# EAGLE board untitled (EAGLE 9.6.2)
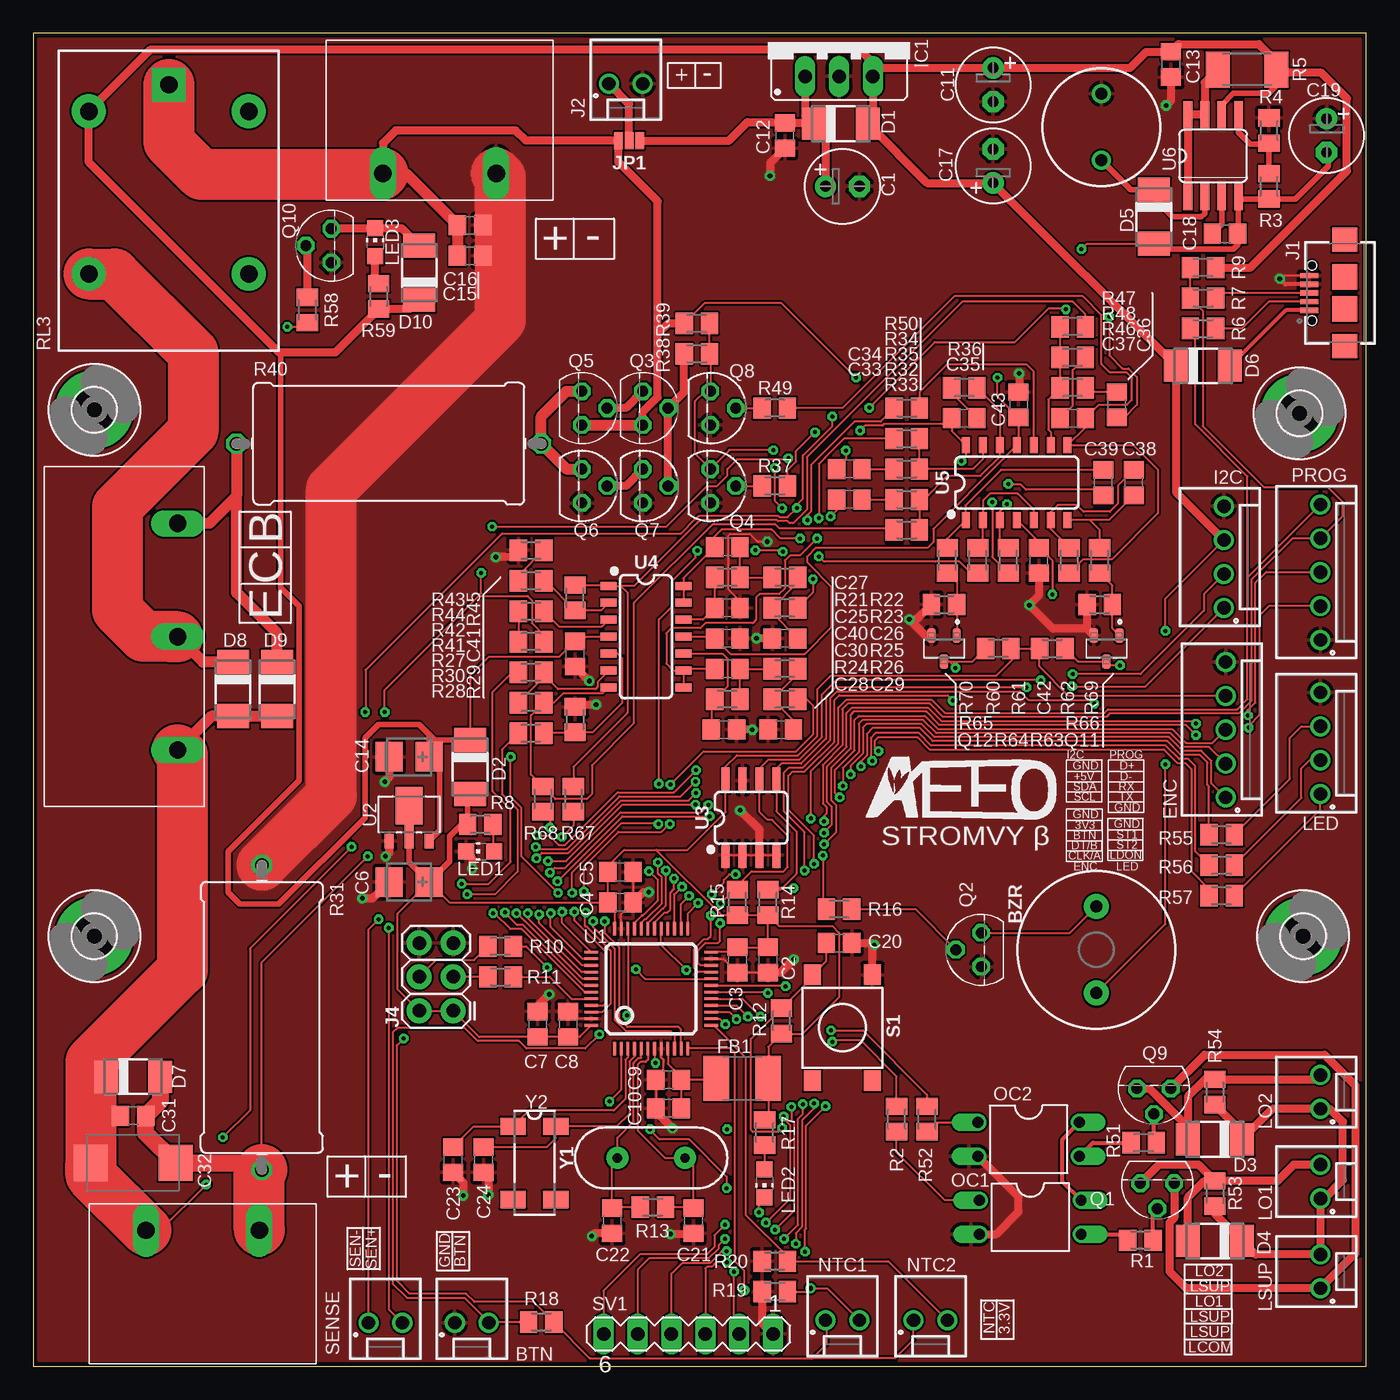
[diagram p1: board, top side]
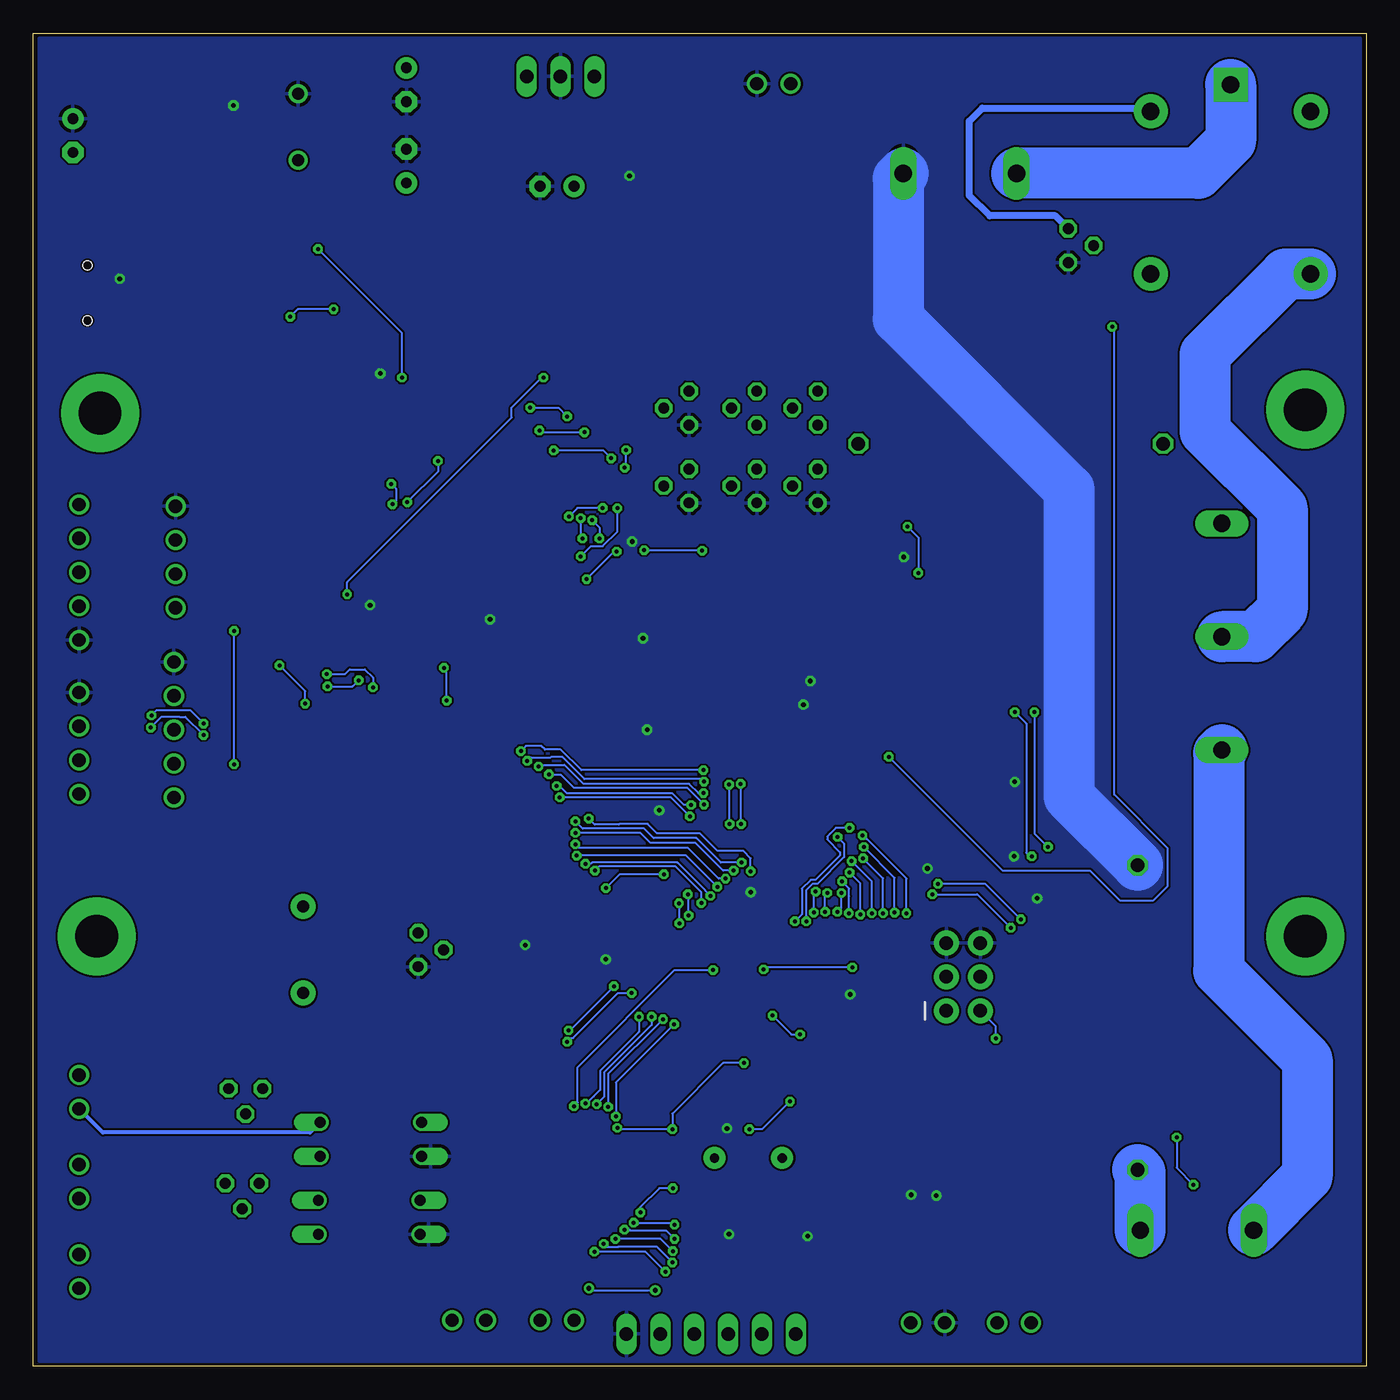
[diagram p2: board, bottom side, seen from below]

Size 100 x 100 mm. Coordinates in mm from the lower left corner, seen from the top.
Outline: 0,0 100,0 100,100 0,100 0,0
Copper layers (1*16): Top 0.035mm / dielectric 1.5mm / Bottom 0.035mm
Design rules "default *": minimum track width 6mil, minimum drill 0.3mm, track to track 6mil, track to pad 6mil, pad to pad 6mil, via to via 6mil, smd to smd 6mil, copper to edge 6mil, drill to drill 6mil, minimum pad ring 10mil, minimum via ring 8mil, stop-mask expansion 4mil, vias tented up to drill 20mil, thermal gap 10mil

## Footprints (pad centres in the part's own frame; a part is rotated, then mirrored left to right if it is on the bottom)
61900211121 = drill 1: 1 1.27,0.3; 2 -1.27,0.3
BUZZER-12MM-KIT = drill 0.9 pad 1.88: + 3.25,0; - -3.25,0
E2,5-6 = drill 0.813 pad 1.6: + -1.27,0 | drill 0.813 pad 1.6 octagon: - 1.27,0
C0805 = smd 1.3 x 1.5: 1 -0.95,0; 2 0.95,0
CT3528 = smd 2 x 2.2: + -1.5,0; - 1.5,0
D/7343-31R = smd 2.55 x 2.7: + 3.175,0; - -3.175,0
DO-214AC = smd 1.8 x 2.4: A 2.025,0; C -2.025,0
61900511121 = drill 1: 1 5.08,0.3; 2 2.54,0.3; 3 0,0.3; 4 -2.54,0.3; 5 -5.08,0.3
L1812 = smd 1.9 x 3.4: 1 -1.95,0; 2 1.95,0
3,2-PAD = drill 3.2 pad 5.842: B3,2 0,0
61900411121 = drill 1: 1 3.81,0.3; 2 1.27,0.3; 3 -1.27,0.3; 4 -3.81,0.3
78XXS = drill 1.016 long: GND 0,-2.54; IN -2.54,-2.54; OUT 2.54,-2.54
KF7.62 = drill 1.3 pad 2 long: 1 -4.25,-5.75; 2 4.25,-5.75
629105136821 = smd 0.4 x 1.35: 1 -1.3,2.325; 2 -0.65,2.325; 3 0,2.325; 4 0.65,2.325; 5 1.3,2.325 | smd 1.8 x 1.9: S1 -4,-0.35; S4 4,-0.35 | smd 1.9 x 1.9: S2 -1.2,-0.35; S3 1.2,-0.35 | hole 0.7: -2.075,2.1; 2.075,2.1
2X3 = drill 1.016 pad 1.88: 1 0,0; 2 0,2.54; 3 2.54,0; 4 2.54,2.54; 5 5.08,0; 6 5.08,2.54
SMT-JUMPER_3_NO_NO-SILK = smd 0.635 x 1.27: 1 -0.813,0; 2 0,0; 3 0.813,0
6000-XXXX-RC = drill 0.9 pad 1.422: 1 -2.5,0; 2 2.5,0
CHIP-LED0805 = smd 1.2 x 1.2: A 0,-1.05; C 0,1.05
DIL04 = drill 0.813 offset: 1 -1.27,-3.81; 2 1.27,-3.81; 3 1.27,3.81; 4 -1.27,3.81
TO92 = drill 0.813 octagon: 1 1.27,0; 2 0,1.905; 3 -1.27,0
SOT23-3 = smd 0.62 x 1.1: 1 -0.95,-0.975; 2 0.95,-0.975; 3 0,0.975
M0805 = smd 1.3 x 1.6: 1 -0.95,0; 2 0.95,0
2010 = smd 1.8 x 2.7: 1 -2.2,0; 2 2.2,0
0922/22 = drill 1.016 octagon: 1 -11.43,0; 2 11.43,0
RELAY_G5LE = drill 1.3 pad 2.54 square: 1 8.52,-0.005 | drill 1.3 pad 2.54: 2 6.52,5.995; 3 -5.68,5.995; 4 -5.68,-6.005; 5 6.52,-6.005
TACTILE_SWITCH_SMD_6.2MM_TALL = smd 1.55 x 1.3: A1 -3.975,-2.25; A2 3.975,-2.25; B1 -3.975,2.25; B2 3.975,2.25
MA06-1 = drill 1.016 long: 1 -6.35,0; 2 -3.81,0; 3 -1.27,0; 4 1.27,0; 5 3.81,0; 6 6.35,0
KF7.62-3P = drill 1.3 pad 2 long: 1 -8.5,-5.75; 2 0,-5.75; 3 8.5,-5.75
TQFP48 = smd 0.2 x 1: 1 -2.75,-4.5; 2 -2.25,-4.5; 3 -1.75,-4.5; 4 -1.25,-4.5; 5 -0.75,-4.5; 6 -0.25,-4.5; 7 0.25,-4.5; 8 0.75,-4.5; 9 1.25,-4.5; 10 1.75,-4.5; 11 2.25,-4.5; 12 2.75,-4.5; 25 2.75,4.5; 26 2.25,4.5; 27 1.75,4.5; 28 1.25,4.5; 29 0.75,4.5; 30 0.25,4.5; 31 -0.25,4.5; 32 -0.75,4.5; 33 -1.25,4.5; 34 -1.75,4.5; 35 -2.25,4.5; 36 -2.75,4.5 | smd 1 x 0.2: 13 4.5,-2.75; 14 4.5,-2.25; 15 4.5,-1.75; 16 4.5,-1.25; 17 4.5,-0.75; 18 4.5,-0.25; 19 4.5,0.25; 20 4.5,0.75; 21 4.5,1.25; 22 4.5,1.75; 23 4.5,2.25; 24 4.5,2.75; 37 -4.5,2.75; 38 -4.5,2.25; 39 -4.5,1.75; 40 -4.5,1.25; 41 -4.5,0.75; 42 -4.5,0.25; 43 -4.5,-0.25; 44 -4.5,-0.75; 45 -4.5,-1.25; 46 -4.5,-1.75; 47 -4.5,-2.25; 48 -4.5,-2.75
SOT89R = smd 0.7 x 1.1: 1 1.5,-1.75; 2 -1.5,-1.75 | smd 0.7 x 1.8: 3 0,-1.4 | smd 2 x 2.8: 4 0,0.9
SO08 = smd 0.61 x 1.905: 1 -1.905,-2.8; 2 -0.635,-2.8; 3 0.635,-2.8; 4 1.905,-2.8 | smd 0.6 x 1.905: 5 1.905,2.8; 6 0.635,2.8; 7 -0.635,2.8; 8 -1.905,2.8
SO14 = smd 0.6 x 1.2: 1 -3.175,-2.8; 2 -1.905,-2.8; 3 -0.635,-2.8; 4 0.635,-2.8; 5 1.905,-2.8; 6 3.175,-2.8; 7 4.445,-2.8; 8 4.445,2.8; 9 3.175,2.8; 10 1.905,2.8; 11 0.635,2.8; 12 -0.635,2.8; 13 -1.905,2.8; 14 -3.175,2.8
SO08' = smd 0.66 x 2.032: 1 -1.905,-3.073; 2 -0.635,-3.073; 3 0.635,-3.073; 4 1.905,-3.073; 5 1.905,3.073; 6 0.635,3.073; 7 -0.635,3.073; 8 -1.905,3.073
HC49US = drill 0.7 pad 1.651: 1 -2.54,0; 2 2.54,0
MC-306 = smd 1.3 x 1.9: 1 -2.75,-1.6; 2 2.75,-1.6; 3 2.75,1.6; 4 -2.75,1.6

## Placement (x,y rotation side)
BTN  [61900211121]  32.89,3.56 180 top
BZR  [BUZZER-12MM-KIT]  79.76,31.24 90 top
C1  10u  [E2,5-6]  60.71,88.52 0 top
C2  100n  [C0805]  55.12,30.48 270 top
C3  10u  [C0805]  52.83,30.48 270 top
C4  100n  [C0805]  44.04,34.8 0 top
C5  10u  [C0805]  44.04,37.08 0 top
C6  10u-tantalum  [CT3528]  28.19,36.32 180 top
C7  100n  [C0805]  37.85,25.65 90 top
C8  10u  [C0805]  40.13,25.65 90 top
C9  100n  [C0805]  47.65,21.49 180 top
C10  1u  [C0805]  47.65,19.35 180 top
C11  10u  [E2,5-6]  72.01,96.14 270 top
C12  330n  [C0805]  56.39,92.33 270 top
C13  100n  [C0805]  85.34,97.66 270 top
C14  10u-tantalum  [CT3528]  28.19,45.72 180 top
C15  4u7  [C0805]  32.77,83.31 0 top
C16  4u7  [C0805]  32.77,85.6 0 top
C17  100u  [E2,5-6]  72.01,90.04 90 top
C18  220p  [C0805]  89.41,84.96 0 top
C19  100u  [E2,5-6]  97.03,92.33 270 top
C20  1u  [C0805]  60.45,31.75 0 top
C21  20p  [C0805]  49.53,10.92 270 top
C22  20p  [C0805]  43.43,10.92 270 top
C23  20p  [C0805]  31.5,15.49 270 top
C24  20p  [C0805]  33.78,15.49 270 top
C25  100n  [C0805]  52.07,56.9 0 top
C26  220n  [C0805]  56.39,54.61 180 top
C27  220n  [C0805]  52.07,61.47 180 top
C28  100n  [C0805]  51.82,47.75 0 top
C29  220n  [C0805]  56.08,47.75 180 top
C30  220n  [C0805]  52.07,52.32 180 top
C31  100n  [C0805]  7.49,18.8 0 top
C32  33u  [D/7343-31R]  7.49,15.24 180 top
C33  1n  [C0805]  61.21,65.02 0 top
C34  1n  [C0805]  61.21,67.31 0 top
C35  220p  [C0805]  69.85,71.12 180 top
C36  1n  [C0805]  81.28,72.14 90 top
C37  2n2  [C0805]  77.98,71.12 0 top
C38  1n  [C0805]  82.55,66.29 270 top
C39  1n  [C0805]  80.26,66.29 90 top
C40  100n  [C0805]  52.07,54.61 180 top
C41  100n  [C0805]  40.64,53.44 90 top
C42  100n  [C0805]  75.44,60.45 270 top
C43  100n  [C0805]  73.91,72.14 90 top
D1  [DO-214AC]  60.58,93.22 0 top
D2  [DO-214AC]  32.77,44.96 270 top
D3  [DO-214AC]  88.65,17.02 180 top
D4  [DO-214AC]  88.65,9.4 180 top
D5  1N5819  [DO-214AC]  84.07,86.23 270 top
D6  [DO-214AC]  87.76,75.06 0 top
D7  [DO-214AC]  7.49,21.72 0 top
D8  [DO-214AC]  14.99,50.8 270 top
D9  [DO-214AC]  18.29,50.8 270 top
D10  [DO-214AC]  28.96,82.04 90 top
ENC  61900511121  [61900511121]  89.15,47.75 270 top
FB1  [L1812]  53.19,21.59 0 top
H1  MOUNT-PAD-ROUND3.2  [3,2-PAD]  4.57,32.26 0 top
H2  MOUNT-PAD-ROUND3.2  [3,2-PAD]  95.25,32.26 0 top
H3  MOUNT-PAD-ROUND3.2  [3,2-PAD]  4.57,71.75 0 top
H4  MOUNT-PAD-ROUND3.2  [3,2-PAD]  95,71.5 0 top
I2C  61900411121  [61900411121]  89.03,60.71 270 top
IC1  7805  [78XXS]  60.45,99.31 0 top
IN  KF7.62-2P  [KF7.62]  30.48,95.25 0 top
J1  629105136821  [629105136821]  98.04,80.52 90 top
J2  [61900211121]  44.45,96.52 180 top
J4  FEMALE 2x3  [2X3]  31.5,26.67 90 top
JP1  [SMT-JUMPER_3_NO_NO-SILK]  44.7,91.95 180 top
L1  100u  [6000-XXXX-RC]  80.14,92.96 90 top
LED  61900411121  [61900411121]  96.27,46.74 270 top
LED1  [CHIP-LED0805]  33.53,38.61 90 top
LED2  [CHIP-LED0805]  54.86,13.72 180 top
LED3  [CHIP-LED0805]  25.65,84.33 0 top
LO1  [61900211121]  96.27,13.84 270 top
LO2  [61900211121]  96.27,20.57 270 top
LSUP  [61900211121]  96.27,7.11 270 top
NTC1  [61900211121]  60.71,3.75 180 top
NTC2  [61900211121]  67.31,3.75 180 top
OC1  PC817  [DIL04]  74.8,11.18 270 top
OC2  PC817  [DIL04]  74.68,17.02 270 top
OUT  KF7.62-2P  [KF7.62]  12.7,4.45 180 top
PROG  61900511121  [61900511121]  96.27,59.56 270 top
Q1  2N3904  [TO92]  84.33,13.72 180 top
Q2  2N3904  [TO92]  71.12,31.24 90 top
Q3  2N3904  [TO92]  45.72,71.88 270 top
Q4  2N3906  [TO92]  50.8,66.04 270 top
Q5  2N3904  [TO92]  41.15,71.88 270 top
Q6  2N3906  [TO92]  41.15,66.04 270 top
Q7  2N3906  [TO92]  45.72,66.04 270 top
Q8  2N3906  [TO92]  50.8,71.88 270 top
Q9  2N3904  [TO92]  84.07,20.83 180 top
Q10  2N3904  [TO92]  22.35,84.07 90 top
Q11  2N7002  [SOT23-3]  80.52,53.85 180 top
Q12  2N7002  [SOT23-3]  68.33,53.85 180 top
R1  1k  [M0805]  83.06,9.45 0 top
R2  680  [M0805]  64.77,18.54 270 top
R3  1k  [M0805]  92.71,88.52 270 top
R4  3k  [M0805]  92.71,92.71 270 top
R5  1  [2010]  91.06,97.28 180 top
R6  20  [M0805]  87.76,77.85 180 top
R7  20  [M0805]  87.76,80.14 180 top
R8  1k  [M0805]  33.53,40.64 0 top
R9  1k5  [M0805]  87.76,82.42 0 top
R10  100k  [M0805]  35.05,31.5 0 top
R11  100k  [M0805]  35.05,29.21 180 top
R12  10k  [M0805]  56.13,25.91 270 top
R13  1M  [M0805]  46.48,11.94 180 top
R14  4k7  [M0805]  55.12,34.8 270 top
R15  4k7  [M0805]  52.83,34.8 270 top
R16  1k  [M0805]  60.45,34.29 0 top
R17  1k  [M0805]  54.86,17.53 270 top
R18  10k  [M0805]  38.1,3.3 0 top
R19  10k  [M0805]  55.63,5.59 0 top
R20  10k  [M0805]  55.63,7.87 0 top
R21  1k  [M0805]  52.07,59.18 0 top
R22  1k8  [M0805]  56.39,59.18 0 top
R23  1k8  [M0805]  56.39,56.9 0 top
R24  1k  [M0805]  52.07,50.04 0 top
R25  1k8  [M0805]  56.39,52.32 0 top
R26  1k8  [M0805]  56.39,50.04 0 top
R27  33k  [M0805]  37.34,52.07 180 top
R28  33k  [M0805]  37.34,47.5 180 top
R29  4k7  [M0805]  40.64,48.51 90 top
R30  4k7  [M0805]  37.34,49.78 0 top
R31  0R1  [0922/22]  17.14,26.16 270 top
R32  220  [M0805]  65.53,65.02 180 top
R33  10k  [M0805]  65.53,62.74 180 top
R34  10k  [M0805]  65.53,69.6 180 top
R35  220  [M0805]  65.53,67.31 180 top
R36  0  [M0805]  69.85,73.41 0 top
R37  100  [M0805]  55.63,66.04 0 top
R38  100  [M0805]  49.78,75.95 0 top
R39  1k  [M0805]  49.78,78.23 0 top
R40  100  [0922/22]  26.67,69.22 0 top
R41  4k7  [M0805]  37.34,54.36 0 top
R42  680  [M0805]  37.34,56.64 180 top
R43  1k8  [M0805]  37.34,61.21 180 top
R44  4k7  [M0805]  37.34,58.93 180 top
R45  33k  [M0805]  40.64,57.66 270 top
R46  220  [M0805]  77.98,73.41 0 top
R47  1k  [M0805]  77.98,77.98 0 top
R48  6k8  [M0805]  77.98,75.69 180 top
R49  100  [M0805]  55.63,71.88 0 top
R50  2k2  [M0805]  65.53,71.88 180 top
R51  1k  [M0805]  83.31,16.76 0 top
R52  680  [M0805]  67.06,18.54 270 top
R53  10k  [M0805]  88.65,12.95 90 top
R54  10k  [M0805]  88.65,20.57 90 top
R55  680  [M0805]  89.15,39.88 180 top
R56  680  [M0805]  89.15,37.59 180 top
R57  680  [M0805]  89.15,35.31 180 top
R58  1k  [M0805]  20.57,79.25 270 top
R59  1k2  [M0805]  25.91,80.26 90 top
R60  100k  [M0805]  70.87,60.45 270 top
R61  100k  [M0805]  73.15,60.45 270 top
R62  100k  [M0805]  77.72,60.45 270 top
R63  4k7  [M0805]  76.45,53.85 180 top
R64  4k7  [M0805]  72.39,53.85 0 top
R65  100k  [M0805]  68.33,57.15 180 top
R66  100k  [M0805]  80.01,57.15 180 top
R67  4k7  [M0805]  40.51,42.55 90 top
R68  4k7  [M0805]  38.23,42.55 90 top
R69  100k  [M0805]  80.01,60.45 270 top
R70  100k  [M0805]  68.58,60.45 270 top
RL3  RELAY-SPDT  [RELAY_G5LE]  10.16,87.63 90 top
S1  [TACTILE_SWITCH_SMD_6.2MM_TALL]  60.71,25.4 90 top
SENSE  [61900211121]  26.42,3.56 180 top
SV1  [MA06-1]  49.15,2.41 180 top
TRAN  KF7.62-3P  [KF7.62-3P]  5.08,54.74 90 top
U1  STM32F103C8T6  [TQFP48]  46.35,28.32 0 top
U2  AMS1117  [SOT89R]  28.19,41.15 0 top
U3  24LC256  [SO08]  53.85,41.15 0 top
U4  LM324  [SO14]  45.97,55.37 270 top
U5  LM324  [SO14]  73.15,66.29 0 top
U6  34063  [SO08']  88.52,90.81 0 top
Y1  8MHz  [HC49US]  46.35,15.62 180 top
Y2  32.768KHz  [MC-306]  37.59,15.24 270 top

## Tracks (layer width: path | path; a pad name or v marks a point on that pad's centre or on a via)
3.3V  (via drill 0.3)
  Top 0.152: R64.2 73.46,53.85 | 73.46,53.85 R63.2 | R63.2 | C4.1 31.22,34.8 C6.+ 27.3,33.93 27.3,28.32 J4.2 J4.1 33.46,24.7 C7.1 C8.1 40.99,24.7 U1.48 | C4.1 C5.1 43.09,37.51 44.32,38.73 46.74,38.73 | C4.1 43.6,34.29 U1.36 | 46.74,38.73 51.62,33.85 R15.2 54.99,33.85 | 54.99,33.85 R14.2 55.95,33.02 59.95,33.02 60.45,32.52 60.45,27.69 57.66,24.89 56.2,24.89 R12.2 55.14,23.96 FB1.2 55.14,18.75 R17.1 | U1.24 52.47,31.07 C3.1 C2.1 55.12,33.72 54.99,33.85 | ENC.4 77.67,50.29 75.49,52.48 R63.2 | 46.74,38.73 49.1,38.73 51.94,41.58 U3.8 51.94,44.98 52.78,45.82 57.35,45.82 58.83,47.3 58.83,50.8 59.84,51.82 72.24,51.82 73.46,53.03 73.46,53.85 | v27.79,24.59 27.28,24.08 27.28,6.4 28.25,5.44 32.49,5.44 33.09,4.83 37.53,4.83 R18.2 41.74,0.61 58.47,0.61 58.5,0.64 | U2.4 U2.3 | 58.5,0.64 59.54,1.68 59.54,3.35 NTC1.1 | 58.5,0.64 64.69,0.64 66.04,1.98 NTC2.1
  Top 0.406: U2.3 28.19,37.82 C6.+ 31.24,37.87 31.24,39.75 32.13,40.64 R8.1 32.58,42.74 D2.A
  Bottom 0.152: v27.79,24.59 27.79,25.5 J4.2
+5V  (via drill 0.3)
  Top 0.152: U4.4 40.98,54.74 C41.2 39.46,53.21 34.16,53.21 32.77,51.82 D2.C | BZR.- 84.94,33.17 v84.94,45.16 | v84.94,55.17 84.94,57.59 I2C.3
  Top 0.406: U6.6 89.15,94.61 90.04,95.5 92.71,95.5 93.26,96.05 93.26,97.03 R5.1 | 18.41,76.07 18.54,75.95 18.54,58.42 19.94,57.02 19.94,43.94 14.61,38.61 14.61,35.56 15.49,34.67 18.41,34.67 24.89,41.15 24.89,47.12 25.91,48.13 28.96,48.13 29.69,47.4 | 29.69,47.4 29.69,45.97 | 29.69,45.97 C14.+ | D2.C 30.11,46.98 29.69,47.4 | U2.1 30.48,40.18 30.48,45.19 29.69,45.97
  Top 0.61: IC1.OUT 62.99,93.61 D1.A 67.05,88.77 C17.+ D6.C 85.73,65.57 I2C.3 | IC1.OUT 63.63,97.41 C11.+ 82.3,97.41 83.5,98.61 C13.1 85.92,99.19 91.95,99.19 93.26,97.88 R5.1 | R9.2 91.31,82.42 98.55,89.66 98.55,95.12 96.65,97.03 93.26,97.03 | D10.C 28.25,79.31 R59.1 22.67,76.07 18.41,76.07 4.17,90.32 RL3.2 8.82,98.81 61.98,98.81 62.99,97.79 IC1.OUT
  Bottom 0.152: v84.94,45.16 v84.94,55.17
+24V  (via drill 0.3)
  Top 0.152: U5.4 75.44,61.84 C42.1 75.5,61.4 76.45,60.45 v76.45,57.91 | v61.72,74.17 56.13,79.76 50.36,79.76 R39.1
  Top 0.61: IN.1 26.23,91.76 27.18,92.71 36.2,92.71 36.96,91.95 JP1.3 43.89,90.35 46.84,87.4 46.84,77.44 | Q3.1 45.72,71.57 46.84,72.69 46.84,77.44 | R39.1 47.62,78.23 46.84,77.44
  Top 0.813: IN.1 27.91,89.5 C16.1 C15.1 | Q5.1 Q3.1
  Top 3.81: RL3.1 10.16,91.84 12.6,89.41 26.14,89.41 IN.1
  Bottom 0.152: v76.45,57.91 76.45,58.83 64.11,71.17 64.11,71.93 61.87,74.17 v61.72,74.17
  Bottom 3.81: RL3.1 10.16,91.94 12.61,89.5 IN.1
-5V  (via drill 0.3)
  Top 0.152: U4.11 50.99,54.74 C40.2 52.29,53.44 57.89,53.44 59.89,55.44 59.89,58.47 58.06,60.3 58.06,60.76 58.73,61.42 67.11,61.42 67.51,61.82 67.51,62.81 72.82,68.12 72.82,68.13 U5.11 73.91,69.22 C43.1 72.34,72.76 v72.34,74.17 | v78.64,83.82 79.03,84.21 D5.A
  Top 0.406: C19.- 97.16,90.93 97.16,90.04 94.68,87.57 R3.2 90.59,87.57 U6.4 90.42,85.03 C18.2 90.36,84.14 90.04,83.82 84.46,83.82 D5.A
  Bottom 0.152: v72.34,74.17 72.34,77.52 v78.64,83.82
BASE
  Top 0.813: R40.1 15.24,65.28 | TRAN.3 13.2,63.24 15.24,65.28 | D9.C 18.29,54.99 15.24,58.04 15.24,65.28
BOOT0
  Top 0.152: R11.1 38.73,29.21 40.39,27.56 U1.44
BOOT1  (via drill 0.3)
  Top 0.152: R10.2 36.98,31.5 v38.56,29.92 | v45.21,29.77 45.91,29.07 U1.20
  Bottom 0.152: v38.56,29.92 45.06,29.92 v45.21,29.77
BUZ_CTL  (via drill 0.3)
  Top 0.152: U1.27 48.1,35.4 v48.68,35.97 | v59.23,38.3 59.23,34.56 R16.1
  Bottom 0.152: v48.68,35.97 51.01,38.3 v59.23,38.3
CC_IND  (via drill 0.3)
  Top 0.152: R63.1 78.38,52.87 80.42,52.87 | 80.42,52.87 Q11.3 | U1.25 49.1,33.97 v49.89,34.75 | v57.86,37.19 57.86,40.08 56.34,41.6 56.34,44.55 56.69,44.91 57.73,44.91 59.79,46.97 59.79,50.12 60.3,50.62 74.01,50.62 74.64,49.99 79.33,49.99 v79.6,49.71 | v81.53,52.58 80.71,52.58 80.42,52.87
  Bottom 0.152: v49.89,34.75 49.89,35.56 51.81,37.48 57.56,37.48 v57.86,37.19 | v79.6,49.71 79.6,50.65 v81.53,52.58
COL
  Top 0.813: D8.C 12.74,52.83 TRAN.2
  Top 3.81: RL3.3 6.09,81.95 11.99,76.05 11.99,70.16 6.3,64.47 6.3,56.74 8.28,54.76 10.31,54.76 10.34,54.74 TRAN.2
  Bottom 3.81: RL3.3 6.04,81.95 12.09,75.89 12.09,70.16 6.3,64.36 6.3,56.74 8.31,54.74 TRAN.2
CV_IND  (via drill 0.3)
  Top 0.152: R64.1 70.47,52.87 Q12.3 68.71,52.87 v69.19,52.4 | U1.26 48.6,34.68 v49.2,35.28 | v58.57,37.69 58.57,39.8 56.64,41.73 56.64,44.3 56.95,44.6 57.86,44.6 60.1,46.84 60.1,49.96 60.45,50.32 68.6,50.32 v68.99,49.94
  Bottom 0.152: v49.2,35.28 49.58,35.66 49.58,35.69 51.69,37.79 58.08,37.79 58.18,37.69 v58.57,37.69 | v68.99,49.94 68.99,52.2 v69.19,52.4
ENC_BTN  (via drill 0.3)
  Top 0.152: U1.38 41.21,30.57 38.82,32.96 v38.82,33.98 | v39.32,36.38 44.2,41.25 v50.75,41.25 | v60.5,42.67 60.16,43.02 60.16,44.75 61.62,46.21 61.62,48.49 61.92,48.8 66.88,48.8 67.87,47.8 85.45,47.8 86.48,46.77 88.47,46.77 ENC.3
  Bottom 0.152: v38.82,33.98 38.82,35.24 38.79,35.27 38.79,35.84 v39.32,36.38 | v50.75,41.25 52.17,42.67 v60.5,42.67
ENC_CLK/A  (via drill 0.3)
  Top 0.152: U1.40 41.14,29.57 37.1,33.62 v37.1,33.98 | v38.61,37.89 39.97,37.89 44.22,42.14 v49.68,42.14 | ENC.1 88.39,43.73 88.39,45.41 87.65,46.16 86.23,46.16 85.19,47.19 67.62,47.19 66.63,48.19 62.51,48.19 62.23,47.9 62.23,45.96 61.32,45.05 v61.32,44.4
  Bottom 0.152: v37.1,33.98 37.1,36.38 v38.61,37.89 | v49.68,42.14 50.93,43.38 59.43,43.38 60.43,44.39 v61.31,44.39 v61.32,44.4
ENC_DT/B  (via drill 0.3)
  Top 0.152: U1.39 41.15,30.07 37.96,33.26 v37.96,33.88 | v38.76,37.03 39.12,37.39 39.9,37.39 44.07,41.55 50.09,41.55 v50.65,42.11 | ENC.2 88.2,46.46 86.35,46.46 85.32,47.5 67.75,47.5 66.75,48.49 62.21,48.49 61.92,48.21 61.92,46.08 60.74,44.9 v60.74,43.53
  Bottom 0.152: v37.96,33.88 37.96,36.23 v38.76,37.03 | v50.65,42.11 51.18,42.11 52.05,42.98 59.95,42.98 60.5,43.53 v60.74,43.53
GND  (via drill 0.35)
  Top 0.152: U1.47 40.66,26.07 40.28,26.46 | C10.2 C9.2 47.26,22.05 47.26,22.98 47.1,23.14 U1.8 | U3.4 U3.3 U3.2 U3.1 | U1.23 51.79,30.57 C3.2 C2.2 | U1.35 44.1,33.91 C4.2 C5.2 | J1.5 93.76,81.82 v93.52,81.58 | C25.2 53.02,57.41 52.14,58.29 52.14,62.31 52.27,62.45 53.77,62.45 54.34,61.87 v55.07,61.87
  Top 0.305: J1.4 93.94,81.17 v93.52,81.58
  Top 0.61: C23.2 32.26,13.78 v32.26,12.8 | C21.2 49.46,9.91 v47.8,9.91 | C22.2 42.13,9.97 v41.91,9.75 | C24.2 34.14,14.19 v34.14,12.85 | C10.2 46.7,19.09 v47.95,17.83 | C8.2 40.28,26.46 | C7.2 37.85,27.03 v38.71,27.89 | C6.- 25.48,35.1 v24.69,35.1 | U2.2 26.69,38.53 v26.42,38.25 | C14.- 26.69,44.17 v26.36,43.84 | LED1.C 32.92,38.17 v32.92,37.34 | C2.2 56.05,29.53 v57.05,30.53 | C20.2 62.94,31.75 v63.09,31.6 62.96,31.46 S1.A2 | U3.3 54.48,40.26 v53.03,41.71 | C4.2 45.76,35.56 v46.18,35.56 | R29.2 40.81,49.63 v42.22,49.63 | v41.71,51.41 41.71,51.42 C41.1 | C26.2 v54.25,54.61 | v53.95,47.75 C28.2 | R65.2 66.26,56.03 v65.73,56.03 66.94,54.82 Q12.2 | C42.2 75.44,57.81 v74.73,57.1 76.5,55.33 79.06,55.33 | R43.2 35.88,60.71 v34.7,60.71 | C43.2 73.97,73.14 v73.97,74.48 | C13.2 85.34,94.94 v84.99,94.59 | C12.2 55.27,90.26 v55.27,89.31 | R19.1 54.68,3.24 SV1.1 | OC1.2 72.24,9.91 73.91,11.58 73.91,12.7 OC2.2 | R66.2 79.06,55.33 | 79.06,55.33 Q11.2
  Top 3.81: R31.1 22.35,42.8 22.35,65.79 35.05,78.49 35.05,89.18 IN.2
  Bottom 3.81: IN.2 35.1,89.13 35.1,78.59 22.3,65.79 22.3,42.75 R31.1
  pour Top: 0.41,99.57 99.57,99.57 99.57,0.46 0.41,0.46
  pour Bottom: 0.46,99.62 99.57,99.62 99.57,0.36 0.46,0.36
I_READ
  Top 0.152: R45.1 43.11,58.61 U4.1 44.07,58.55 | R67.2 40.51,44.96 44.58,49.02 44.58,58.04 44.07,58.55 | R47.2 78.93,78.93 77.98,79.88 69.72,79.88 58.04,68.2 58.04,64.26 57.02,63.25 56.74,63.25 56.59,63.4 55.85,63.4 55.75,63.5 50.06,63.5 49.81,63.25 49.78,63.25 45.09,58.55 44.07,58.55
I_SERVO
  Top 0.152: R49.2 60.71,71.88 69.09,80.26 78.74,80.26 80.14,78.87 80.14,75.18 80.77,74.55 82.04,74.55 82.42,74.17 82.42,72.51 82.05,72.14 79.94,72.14 C37.2 78.93,70.42 U5.8 82.54,69.09 84.38,67.26 84.38,64 80.91,60.52 78.75,60.52 R62.2
I_SET  (via drill 0.3)
  Top 0.152: U1.45 42.77,27.07 43.03,27.33 43.03,30.99 40.59,33.43 v40.59,34.09 | v40.44,35.51 40.44,37.06 44.13,40.76 46.8,40.76 v46.89,40.67 | v46.94,43.69 46.94,56.03 47.95,57.04 47.95,58.94 49.68,60.68 49.68,61.21 49.78,61.21 v49.81,61.18 | v54.18,61.21 56.13,61.21 v56.23,61.12 | v58.49,59.05 58.49,58.05 R23.2
  Bottom 0.152: v40.59,34.09 40.59,35.36 v40.44,35.51 | v46.89,40.67 46.89,43.64 v46.94,43.69 | v49.81,61.18 54.15,61.18 v54.18,61.21 | v56.23,61.12 56.42,61.12 v58.49,59.05
LCOM
  Top 0.61: Q1.3 85.6,11.12 85.26,10.79 85.26,7.09 86.51,5.84 LSUP.1 99.19,8.46 99.19,21.06 96.88,23.37 87.88,23.37 Q9.3
LD_BTN  (via drill 0.3)
  Top 0.152: R18.1 34.21,3.3 34.2,3.29 | 34.2,3.29 BTN.2 | U1.34 44.6,26.37 v44.54,26.31 | v42.47,24.89 41.4,23.82 37,23.82 36.43,24.4 33.34,24.4 32.35,25.39 27.32,25.39 26.98,25.04 26.98,6.2 28.04,5.13 32.36,5.13 34.2,3.29
  Bottom 0.152: v44.54,26.31 43.13,24.89 v42.47,24.89
LD_EN  (via drill 0.3)
  Top 0.152: U1.37 39.67,33.25 v39.67,34.09 | v39.37,35.51 36.63,38.25 36.63,41.88 35.81,42.7 v35.81,45.72 | v19.05,77.98 20.25,77.98 R58.2
  Bottom 0.152: v39.67,34.09 39.37,34.39 v39.37,35.51 | v35.81,45.72 27.28,37.19 20.73,37.19 18.49,34.95 15.95,34.95 14.88,36.02 14.88,38.86 18.9,42.88 18.9,77.83 v19.05,77.98
LED_LDON  (via drill 0.3)
  Top 0.152: U1.43 41.35,28.07 36.63,32.79 35.8,32.79 34.61,33.98 v34.49,33.98 | v37.8,39.82 38.72,39.82 39.42,39.12 39.91,39.12 40.45,39.66 40.5,39.71 43.84,43.05 48.06,43.05 49.44,44.44 49.46,44.44 v49.73,44.71 | v63.42,46.15 63.14,46.43 63.14,46.94 63.4,47.19 66.32,47.19 67.23,46.28 84.81,46.28 85.85,45.24 86.43,45.24 86.87,44.81 86.87,37.16 88.2,35.82 R57.2
  Bottom 0.152: v37.8,39.82 37.52,39.54 37.45,39.54 34.49,36.58 v34.49,33.98 | v49.73,44.71 58.89,44.71 60.43,46.26 61.62,46.26 61.9,46.53 63.04,46.53 v63.42,46.15
LED_ST1  (via drill 0.3)
  Top 0.152: U1.41 41.21,29.07 36.88,33.4 36.86,33.4 36.28,33.98 v36.24,33.98 | v37.74,38.1 38.15,38.51 40.16,38.51 44.09,42.44 49.16,42.44 v49.72,42.99 | R55.2 88.2,43.49 88.09,43.61 88.09,45.29 87.52,45.85 86.1,45.85 85.07,46.89 67.49,46.89 66.5,47.88 62.97,47.88 62.53,47.45 62.53,45.83 62.09,45.39 v62.09,44.99
  Bottom 0.152: v36.24,33.98 36.24,36.59 v37.74,38.1 | v49.72,42.99 50.11,42.99 50.8,43.69 58.73,43.69 60.15,45.12 61.97,45.12 v62.09,44.99
LED_ST2  (via drill 0.3)
  Top 0.152: U1.42 41.28,28.57 36.75,33.1 36.3,33.1 35.66,33.74 35.66,33.76 v35.38,34.04 | v37.69,38.96 37.84,38.81 40.03,38.81 43.97,42.75 48.57,42.75 v49.68,43.85 | R56.2 87.17,38.62 87.17,45.04 86.67,45.55 85.97,45.55 84.94,46.58 67.36,46.58 66.45,47.5 63.2,47.5 62.84,47.14 62.84,45.52 v62.94,45.41
  Bottom 0.152: v35.38,34.04 35.38,36.65 v37.69,38.96 | v49.68,43.85 49.87,44.04 58.65,44.04 60.3,45.7 61.16,45.7 61.19,45.68 62.68,45.68 v62.94,45.41
LO1
  Top 0.61: LO1.2 94.56,15.11 93.36,13.9 89,13.9 R53.2 | Q1.1 84.48,15.14 87.41,15.14 R53.2 | D4.A 86.62,12.66 87.87,13.9 R53.2
LO2
  Top 0.61: LO2.2 96.25,21.52 R54.2 87.92,21.52 86.62,20.23 86.62,17.96 | D3.A 86.62,17.37 86.62,17.96 | Q9.1 83.75,20.83 86.62,17.96
LSUP
  Top 0.305: OC1.4 77.22,13.84 77.22,17.02 OC2.4
  Top 0.61: R53.1 88.65,11.42 D4.C 91.69,8.38 LSUP.2 LO1.1 96.85,12.57 98.25,13.97 98.25,18.34 97.28,19.3 LO2.1 92.96,19.3 D3.C 90.67,17.6 R54.1
  Bottom 0.305: OC2.4 79.25,17.53 94.79,17.53 LO2.1
N$1
  Top 0.61: JP1.1 52.2,91.95 53.59,93.34 56.32,93.34 C12.1 58.49,93.28 D1.C | IC1.IN 57.91,93.86 D1.C | D1.C 59.44,92.34 C1.+
N$2
  Top 0.305: R1.2 84.01,11.49 Q1.2
N$3
  Top 0.61: J2.1 44.7,94.7 JP1.2
N$4
  Top 0.152: R8.2 34.48,38.71 LED1.A
N$5
  Top 0.305: OC1.3 81.65,9.91 R1.1
N$6
  Top 0.305: J1.1 93.95,79.22 D6.A
N$7
  Top 0.305: R51.2 84.07,16.95 Q9.2
N$8
  Top 0.305: OC2.3 79.5,16.76 R51.1
N$9
  Top 0.152: R52.2 67.75,18.29 OC2.1
N$10
  Top 0.152: OC1.1 68.38,12.45 64.77,16.05 R2.2
N$11
  Top 0.152: C9.1 C10.1 | C9.1 48.7,21.59 47.6,22.69 U1.9 | FB1.1 51.14,21.49 C9.1
N$12
  Top 0.406: C18.1 89.15,85.66 U6.3
N$14
  Top 0.406: L1.1 82.34,88.26 D5.C 84.07,87.63 85.47,86.23 87.63,86.23 87.88,86.49 U6.2
N$15
  Top 0.61: R5.2 87.88,96.31 U6.7 U6.8 U6.1
N$16
  Top 0.152: J1.3 89.09,80.52 R7.1
N$17
  Top 0.406: U6.5 90.42,92.58 91.31,91.69 92.64,91.69 R4.2 R3.1
N$18
  Top 0.152: J1.2 92.69,79.87 90.68,77.85 R6.1
N$19
  Top 0.152: R11.2 J4.3
N$20
  Top 0.152: J4.4 30.23,30.48 33.09,30.48 R10.1
N$21
  Top 0.152: R16.2 66.17,34.29 Q2.2
N$22
  Top 0.152: R17.2 LED2.A
N$23
  Top 0.152: Q2.1 77.78,32.51 BZR.+
N$24
  Top 0.152: U4.10 51.7,53.47 52,53.17 52,53.16 52.07,53.09 52.07,50.99 R24.1 50.87,49.78 C28.1
N$25
  Top 0.152: R25.2 57.34,51.94 R26.1 57.03,48.44 C29.1
N$26
  Top 0.152: R25.1 C30.1 R24.2
N$27
  Top 0.61: R38.1 48.83,73.09 Q3.2 Q7.2
N$28
  Top 0.152: R30.1 38.29,51.68 38.29,51.87 | 38.29,51.87 R27.1 | U4.6 43.17,52.15 42.34,51.32 42.34,50.98 42.16,50.8 39.35,50.8 38.29,51.87
N$29
  Top 0.152: R28.1 40.57,47.5 R29.1 41.98,47.56 44.2,49.78 44.2,53.09 43.81,53.47 U4.5
N$30
  Top 0.152: R21.1 C25.1 50.23,56.01 U4.12
N$31
  Top 0.152: C27.1 R21.2 R22.1
N$32
  Top 0.152: R22.2 57.34,58.8 R23.1 55.44,56.51 C26.1
N$33
  Top 0.61: Q7.3 44.45,66.04 Q6.2
N$34  (via drill 0.3)
  Top 0.152: R68.1 38.76,41.06 v38.76,40.4 | v42.87,33.38 42.87,32.52 43.94,31.44 43.94,26.09 44.58,25.45 48.41,25.45 48.6,25.26 U1.11
  Bottom 0.152: v38.76,40.4 39.78,40.4 40.24,39.95 40.24,39.93 40.44,39.73 40.44,39.52 39.47,38.56 39.47,38.33 41.3,36.5 41.67,36.5 42.34,35.83 42.34,33.91 v42.87,33.38
N$35
  Top 0.152: R36.2 72.52,71.69 U5.12 72.52,68.25 71.07,66.8 68.58,66.8 66.8,65.02 R32.1 R33.1
N$36
  Top 0.152: R57.1 96.57,41.77 LED.1
N$37
  Top 0.152: C33.2 R32.2
N$38
  Top 0.813: Q5.3 40.01,73.15 38.1,71.25 R40.2 40.01,67.31 Q6.3
N$39
  Top 0.61: Q3.3 44.45,71.88 Q5.2
N$40
  Top 0.152: C35.1 68.9,73.02 R36.1
N$41  (via drill 0.3)
  Top 0.152: R67.1 40.51,40.56 v39.65,39.7 | v42.01,33.38 42.01,32.94 43.64,31.32 43.64,25.96 44.45,25.15 47.8,25.15 48.11,24.84 U1.10
  Bottom 0.152: v39.65,39.7 39.17,39.22 39.17,38.2 41.18,36.19 41.54,36.19 42.03,35.7 42.03,33.8 42.01,33.78 v42.01,33.38
N$42
  Top 0.152: C34.2 R35.2
N$43
  Top 0.152: R34.1 R35.1 70.48,67.31 71.25,68.07 U5.13
N$44
  Top 0.152: Q4.2 R37.1
N$45
  Top 0.152: R70.2 69.28,58.81 R65.1 Q12.1
N$46
  Top 0.152: R42.2 R41.1
N$47
  Top 0.152: R42.1 39.43,55.5 42.67,55.5 U4.3
N$48
  Top 0.152: R44.1 38.42,58.93 R45.2 42.6,56.71 U4.2
N$49
  Top 0.152: R43.1 36.39,59.31 R44.2
N$50
  Top 0.152: Q11.1 80.96,55.33 R66.1 80.96,58.55 R69.2
N$51
  Top 0.152: R69.1 80.01,62.74 79.25,63.49 | 79.25,63.49 U5.7 | C38.2 80.7,63.49 79.25,63.49
N$52
  Top 0.152: C36.2 79.25,73.09 R46.2
N$53
  Top 0.152: U5.9 76.33,70.1 76.15,70.28 76.15,72.53 R46.1 77.03,75.56 R48.2 R47.1
N$54
  Top 0.152: C37.1 77.98,72.07 77.98,74.74 R48.1
N$56
  Top 0.152: U5.10 75.06,74.62 74.55,75.13 68.53,75.13 66.48,73.09 R50.1
N$57
  Top 0.152: Q8.2 R49.1
N$58
  Top 0.152: R56.1 95.15,42.64 95.15,44.86 95.76,45.47 LED.2
N$59
  Top 0.152: R55.1 94.28,44.06 94.28,47.14 95.15,48.01 LED.3
N$61
  Top 0.61: Q10.1 25.62,85.34 LED3.C 27.64,85.38 D10.A
  Bottom 0.508: Q10.1 23.32,86.31 28.25,86.31 29.77,87.83 29.77,93.42 28.8,94.39 16.4,94.39 RL3.5
N$62
  Top 0.152: R60.1 71.25,61.78 U5.2 71.25,64.95 71.75,65.46 73.86,65.46 75.06,64.26 U5.5
N$64
  Top 0.61: R58.1 20.57,83.95 Q10.2
N$65
  Top 0.61: R59.2 25.65,81.47 LED3.A
N$66  (via drill 0.3)
  Top 0.152: R61.1 72.52,62.04 U5.3 72.52,64.14 v73.05,64.67 | v73.15,66.19 73.17,66.17 74.04,66.17 74.46,65.75 79.86,65.75 C39.1
  Bottom 0.152: v73.05,64.67 72.8,64.92 72.8,65.83 v73.15,66.19
N$67
  Top 0.152: R70.1 68.58,62.1 69.92,63.43 | 69.92,63.43 U5.1 | C39.2 72.58,67.24 69.92,64.58 69.92,63.43
N$69
  Top 0.152: R62.1 76.33,62.8 U5.6 76.33,64.08 76.86,64.62 78.28,64.62 78.79,64.11 80.77,64.11 81.38,64.72 81.38,66.08 C38.1
NRST  (via drill 0.3)
  Top 0.152: C20.1 59.5,30.42 S1.B2 58.46,29.18 R12.1 53.84,24.56 53.84,17.73 53.99,17.58 55.88,17.58 v56.19,17.88 | U1.7 46.6,22.82 v46.68,22.74
  Bottom 0.152: v46.68,22.74 48.25,22.74 52.05,18.94 v52.05,17.78 56.08,17.78 v56.19,17.88
NTC1  (via drill 0.35)
  Top 0.152: U1.12 52.32,23.82 52.63,23.52 52.63,7.87 53.34,7.16 v53.34,5.69 | R19.2 58.06,5.59 v58.32,5.84 59.58,5.84 NTC1.2
  Bottom 0.152: v58.32,5.84 58.17,5.69 v53.34,5.69
NTC2
  Top 0.152: U1.13 51.06,25.57 53.45,23.18 53.45,11.37 56.58,8.24 R20.2 64.15,7.87 NTC2.2
OSC32_IN
  Top 0.152: U1.4 45.1,23.24 44.73,22.86 44.73,18.95 43.77,17.99 Y2.4 39.19,17.09 38.54,16.44 C24.1
OSC32_OUT
  Top 0.152: U1.3 44.6,23.17 44.42,22.99 44.42,20.04 43.56,19.18 37.18,19.18 Y2.1 33.04,17.99 C23.1
OSC_IN
  Top 0.152: U1.5 45.6,23.14 45.59,23.13 45.42,23.13 45.03,22.74 45.03,18.36 43.81,17.14 Y1.2 43.43,15.24 C22.1 43.5,11.94 R13.2
OSC_OUT
  Top 0.152: U1.6 46.1,22.99 45.94,22.82 45.55,22.82 45.34,22.61 45.34,17.68 47.4,15.62 Y1.1 49.53,14.99 C21.1 49.46,11.94 R13.1
OUT+  (via drill 0.3)
  Top 0.152: C32.+ 4.32,16.57 6.45,18.7 | 6.45,18.7 C31.1 | D7.C 5.47,19.68 6.45,18.7 | v59.82,63.75 60.26,64.2 C33.1 | v59.94,71.25 59.94,70.53 57.73,68.33 57.73,65.1 57.28,64.64 v57.28,64.39 56.59,63.7 55.98,63.7 55.88,63.8 49.94,63.8 49.68,63.55 49.66,63.55 48.59,62.48 35.18,62.48 24.93,52.23 24.93,49.11 v24.89,49.07 | v62.71,71.91 67.64,76.83 73.66,76.83 76.2,79.38 77.4,79.38 v77.47,79.3 | v80.72,78.74 80.72,75.85 81.71,74.85 82.17,74.85 82.8,74.22 82.8,72.14 81.85,71.19 C36.1 | v23.88,38.96 16.26,31.34 16.26,19.2 v14.22,17.17 | v12.95,13.61 9.54,10.2 OUT.2
  Top 0.813: TRAN.1 13.37,48.77 D8.A D9.A
  Top 3.81: TRAN.1 11.18,45.89 11.18,29.72 4.32,22.86 C32.+ 4.32,14.33 OUT.2
  Bottom 0.152: v57.28,64.39 59.18,64.39 v59.82,63.75 | v59.94,71.25 60.6,71.91 v62.71,71.91 | v77.47,79.3 80.16,79.3 v80.72,78.74 | v24.89,49.07 24.89,39.98 v23.88,38.96 | v14.22,17.17 14.22,14.88 v12.95,13.61
  Bottom 3.81: TRAN.1 11.07,45.99 11.07,29.67 4.42,23.01 4.42,14.22 OUT.2
OUT-  (via drill 0.3)
  Top 0.152: 33.4,57.78 26.36,50.75 v26.36,49.07 | R41.2 38.29,54.87 37.41,55.75 37.41,57.46 37.08,57.78 33.4,57.78 | 33.4,57.78 33.6,57.99 v33.6,59.51 | v56.64,68.12 56.54,68.02 52.78,68.02 52.07,67.31 52.07,66.8 51.31,66.04 50.55,66.04 47.5,62.99 v34.42,62.99 | v60.96,68.71 60.96,68.01 C34.1 | R31.2 17.14,30.3 v25.09,38.25
  Top 1.27: D7.A 9.52,19.87 C31.2 8.44,17.46 C32.- 16.25,15.24 16.95,14.54
  Top 3.81: OUT.1 16.95,14.54 R31.2
  Bottom 0.152: v34.42,62.99 33.6,62.18 v33.6,59.51 | v56.64,68.12 57.23,68.71 v60.96,68.71 | v25.09,38.25 25.25,38.25 25.5,38.51 25.5,48.21 v26.36,49.07
  Bottom 3.81: OUT.1 16.95,14.54 R31.2
PA4  (via drill 0.3)
  Top 0.152: U1.14 51.5,26.07 v51.92,25.65 | v56.29,18.74 56.29,18.6 56.77,18.12 56.77,12.57 v54.97,10.77 | v51.9,10.62 51.1,9.83 51.1,8.94 50.55,8.38 45.52,8.38 42.77,5.64 42.77,2.44 SV1.6
  Bottom 0.152: v51.92,25.65 56.29,21.29 v56.29,18.74 | v54.97,10.77 52.05,10.77 v51.9,10.62
PA5  (via drill 0.3)
  Top 0.152: U1.15 52.22,26.57 v52.75,26.03 | v56.87,19.46 56.87,18.45 57.07,18.25 57.07,11.66 v55.65,10.24 | v51.9,9.55 51.41,9.06 51.41,8.81 50.67,8.08 46.18,8.08 45.34,7.24 SV1.5
  Bottom 0.152: v52.75,26.03 56.87,21.92 v56.87,19.46 | v55.65,10.24 55.26,10.24 55.21,10.19 52.53,10.19 v51.9,9.55
PA6  (via drill 0.3)
  Top 0.152: U1.16 52.75,27.07 v53.61,26.21 | SV1.4 47.88,6.93 48.72,7.77 50.8,7.77 51.66,8.64 v52.02,8.64 | v56.34,9.55 57.38,10.59 57.38,18.57 57.73,18.92 v57.73,19.66
  Bottom 0.152: v53.61,26.21 53.61,25.61 57.17,22.04 57.17,20.21 v57.73,19.66 | v52.02,8.64 52.93,9.55 v56.34,9.55
PA7  (via drill 0.3)
  Top 0.152: U1.17 53.2,27.57 v54.56,26.21 | v58.59,19.71 58.59,19.34 57.68,18.44 57.68,10.46 57.2,9.98 v57.2,9.18 | v52.05,7.78 51.23,7.78 50.92,7.47 50.55,7.47 50.42,7.34 SV1.3
  Bottom 0.152: v54.56,26.21 54.56,25.09 57.48,22.17 57.48,20.73 57.96,20.24 57.97,20.24 58.5,19.71 v58.59,19.71 | v57.2,9.18 56.99,8.97 56.1,8.97 56.07,8.99 53.26,8.99 v52.05,7.78
PA8  (via drill 0.3)
  Top 0.152: SV1.2 52.58,2.79 v52.58,7.1 | v57.91,8.59 57.91,10.26 57.99,10.34 57.99,18.05 v59.45,19.51 | v49,29.72 47.1,31.61 U1.29
  Bottom 0.152: v52.58,7.1 54.07,8.59 v57.91,8.59 | v59.45,19.51 59.17,19.78 59.17,22.43 51.88,29.72 v49,29.72
PC13_LED  (via drill 0.3)
  Top 0.152: U1.2 44.1,20.74 v43.23,19.86 | v46.28,17.78 46.28,17.73 46.99,17.02 49.23,17.02 52.02,14.22 v52.02,13.36 | v54.46,11.53 54.46,12.26 LED2.C
  Bottom 0.152: v43.23,19.86 45.31,17.78 v46.28,17.78 | v54.46,11.53 54.46,11.94 53.03,13.36 v52.02,13.36
POST_ISET  (via drill 0.3)
  Top 0.152: C27.2 51.09,61.44 | 51.09,61.44 48.77,59.12 U4.14 U4.13 | R50.2 63.57,70.87 61.59,70.87 58.34,67.61 58.34,64.14 58.07,63.86 v58.07,63.47 | v57.53,62.1 56.06,62.1 55.41,62.75 51.63,62.75 51.09,62.21 51.09,61.44
  Bottom 0.152: v58.07,63.47 57.53,62.93 v57.53,62.1
POST_VSET  (via drill 0.3)
  Top 0.152: C30.2 48.9,52.32 U4.9 | U4.9 U4.8 | R34.2 60.83,69.6 59.38,68.16 59.38,68.15 58.93,67.69 v58.93,63.63 | v58.8,62.1 57.53,60.83 56.77,60.83 56.39,60.45 56.39,58.36 55.95,57.92 54.5,57.92 54.23,57.66 54.23,56.01 53.98,55.75 50.42,55.75 50.04,55.37 47.88,55.37 47.5,54.99 47.5,52.7 48.01,52.2 U4.9
  Bottom 0.152: v58.93,63.63 58.93,62.23 v58.8,62.1
PRE_LO1  (via drill 0.3)
  Top 0.152: R2.1 64.77,21.74 62.08,24.43 60.04,24.43 v59.94,24.34 | U1.18 55.02,28.07 v55.1,27.99
  Bottom 0.152: v59.94,24.34 59.67,24.61 59.5,24.61 56.13,27.99 v55.1,27.99
PRE_LO2  (via drill 0.3)
  Top 0.152: U1.19 56.37,28.57 v56.44,28.5 | v59.84,25.2 62.23,25.2 67.06,20.37 R52.1
  Bottom 0.152: v56.44,28.5 59.74,25.2 v59.84,25.2
RX  (via drill 0.3)
  Top 0.152: v47.46,37.18 47.46,34.56 47.24,34.34 47.2,34.34 46.1,33.24 U1.31 | v59.33,40.02 59.33,40.06 59.92,40.64 59.92,41.97 59.55,42.34 59.55,45 61.01,46.46 61.01,49 61.42,49.41 67.13,49.41 68.12,48.41 87.02,48.41 v87.22,48.21 | v91.14,48.82 91.14,49.23 91.69,49.78 91.69,58.78 92.51,59.59 96.54,59.59 PROG.3
  Bottom 0.152: v87.22,48.21 88.24,49.23 90.73,49.23 v91.14,48.82 | v59.33,40.02 54.45,40.02 53.69,39.26 50.33,39.26 48.25,37.18 v47.46,37.18
SCL  (via drill 0.3)
  Top 0.152: R15.1 52.83,35.76 | 52.83,35.76 52.83,36.07 53.9,37.13 56.29,37.13 56.59,37.44 56.59,39.83 55.42,41 55.07,41 54.48,41.58 U3.6 54.48,44.83 55.17,45.52 57.48,45.52 59.18,47.22 59.18,50.39 60.3,51.51 75.54,51.51 v75.59,51.46 | U1.22 50.04,30.07 49.89,30.23 49.89,31.19 50.44,31.75 51.36,31.75 51.53,31.92 v51.53,33.22 | v51.56,34.74 52.58,35.76 52.83,35.76 | v77.93,51 83.43,51 I2C.1
  Bottom 0.152: v51.53,33.22 51.53,34.71 v51.56,34.74 | v75.59,51.46 76.05,51 v77.93,51
SDA  (via drill 0.3)
  Top 0.152: U3.5 55.75,43.84 | 55.75,43.84 55.75,41.63 57.25,40.13 57.25,36.93 56.07,35.75 55.22,35.75 | 55.22,35.75 R14.1 | U1.21 49.88,29.57 49.58,29.87 49.58,31.32 50.32,32.05 50.6,32.05 50.83,32.29 v50.83,33.81 | v50.89,35.4 51.8,36.31 51.8,36.49 52.21,36.9 v52.69,36.9 | v57.05,35.87 55.34,35.87 55.22,35.75 | I2C.2 87.83,57.94 87.83,56.69 83.06,51.92 v77.98,51.92 | v74.52,50.93 60.17,50.93 59.49,50.24 59.49,47.09 57.61,45.21 56.13,45.21 55.73,44.81 55.73,43.87 55.75,43.84
  Bottom 0.152: v50.83,33.81 50.83,35.34 v50.89,35.4 | v52.69,36.9 56.01,36.9 v57.05,35.87 | v77.98,51.92 76.61,51.92 76.25,52.27 75.13,52.27 74.52,51.66 v74.52,50.93
SENSE+  (via drill 0.3)
  Top 0.152: v32.55,35.4 34.63,35.4 36.27,37.03 36.32,37.08 36.32,41.76 35.15,42.93 35.15,46.26 R28.2 | v26.67,32.89 26.67,4.27 SENSE.2
  Bottom 0.152: v32.55,35.4 29.17,35.4 v26.67,32.89
SENSE-  (via drill 0.3)
  Top 0.152: SENSE.1 25.15,32.77 v25.91,33.53 | v32.13,36.2 34.16,36.2 35.81,37.85 35.81,41.78 34.47,43.13 34.47,50.6 35.94,52.07 R27.2
  Bottom 0.152: v25.91,33.53 28.57,36.2 v32.13,36.2
TX  (via drill 0.3)
  Top 0.152: v48.07,36.58 48.07,35.79 47.8,35.52 47.8,34.29 47.55,34.04 47.35,34.04 46.6,33.3 U1.30 | PROG.2 92.69,57.02 92,56.34 92,48.86 91.19,48.05 v91.19,47.9 | v87.22,47.35 86.47,48.11 68,48.11 67,49.1 61.55,49.1 61.32,48.87 61.32,46.34 59.85,44.87 59.85,42.47 60.22,42.1 60.22,40.05 v59.33,39.16
  Bottom 0.152: v48.07,36.58 48.58,36.58 50.91,38.91 59.08,38.91 v59.33,39.16 | v91.19,47.9 90.36,48.73 89.05,48.73 89.03,48.72 88.59,48.72 v87.22,47.35
USB_D+  (via drill 0.3)
  Top 0.152: U1.33 45.1,33.27 45.66,33.82 45.74,33.82 46.85,34.94 46.85,36.47 46.19,37.13 v46.18,37.13 | v58.33,41.09 58.33,44.64 60.4,46.71 60.4,49.43 60.99,50.02 67.38,50.02 68.38,49.02 80.37,49.02 80.62,49.28 90.32,49.28 91.08,50.04 91.08,59.16 | 91.08,59.16 PROG.5 | 91.08,59.16 91.08,66.75 87.17,70.66 87.17,77.48 R6.2
  Bottom 0.152: v58.33,41.09 57.88,40.64 56.06,40.64 56.01,40.69 53.9,40.69 53.19,39.98 49.99,39.98 48.67,38.66 46.74,38.66 46.18,38.1 v46.18,37.13
USB_D-  (via drill 0.3)
  Top 0.152: R9.1 R7.2 87.73,79.21 87.73,70.53 92.33,65.94 97.13,65.94 98.2,64.87 98.2,63.73 PROG.4 94.46,62.1 91.39,59.03 91.39,49.91 90.45,48.97 80.75,48.97 80.49,48.72 68.25,48.72 67.26,49.71 61.11,49.71 60.71,49.3 60.71,46.59 59.24,45.12 59.24,42.22 59.52,41.94 59.52,41.46 59.33,41.27 v59.33,40.88 | U1.32 45.6,33.24 45.91,33.55 45.98,33.55 47.16,34.73 47.16,36.67 46.88,36.94 46.88,37.77 v46.86,37.79
  Bottom 0.152: v59.33,40.88 58.78,40.33 54.17,40.33 53.46,39.62 50.25,39.62 48.42,37.79 v46.86,37.79
V_READ
  Top 0.152: R33.2 64.52,62.8 64.45,62.87 64.43,62.89 55.94,62.89 55.63,63.2 51,63.2 45.09,57.28 45.09,48.26 41.91,45.09 41.91,42.93 41.53,42.55 39.18,42.55 R68.2 37.34,44.38 37.34,48.83 R30.2 39.06,49.78 39.78,50.49 42.74,50.49 U4.7
V_SERVO  (via drill 0.3)
  Top 0.152: v62.03,70.21 62.38,70.56 63.69,70.56 63.79,70.66 68.44,70.66 C35.2 68.9,70.17 U5.14 69.98,68.25 v69.65,67.92 | R37.2 56.58,67.23 57.22,67.88 57.22,68.64 v58.66,70.07 | v71.94,64.82 71.94,60.72 R61.2
  Bottom 0.152: v62.03,70.21 61.89,70.07 v58.66,70.07 | v69.65,67.92 69.65,67.11 v71.94,64.82
V_SET  (via drill 0.3)
  Top 0.152: v41.45,34.04 41.39,33.98 41.39,33.06 41.48,32.97 41.55,32.97 43.13,31.39 43.13,31.32 43.33,31.11 43.33,27.2 42.89,26.76 42.87,26.74 42.7,26.57 U1.46 | v41.3,35.61 41.3,37.49 43.9,40.09 47.13,40.09 47.71,40.67 v47.75,40.67 | v47.8,43.63 50.29,46.13 57.23,46.13 58.52,47.42 58.52,49.53 58.01,50.04 R26.2
  Bottom 0.152: v41.45,34.04 41.45,35.46 v41.3,35.61 | v47.75,40.67 47.75,43.59 v47.8,43.63
VI_SERVO  (via drill 0.3)
  Top 0.152: R39.2 R38.2 50.8,75.88 Q8.3 50.42,73.15 49.66,72.39 49.66,68.45 Q4.3 52.22,68.73 v55.52,68.73 | R60.2 70.35,59.5 69.47,60.38 67.69,60.38 67.66,60.35 59.33,60.35 v58.93,60.76 | v56.19,64.36 55.63,64.92 v55.63,67.41
  Bottom 0.152: v58.93,60.76 58.16,61.52 57.29,61.52 56.19,62.63 v56.19,64.36 | v55.63,67.41 55.52,67.51 v55.52,68.73

## Text on the board
tPlace: + | - | - | + | B | C | E | I2C | PROG | GND | D+ | +5V | D- | SDA | RX | SCL | GND | TX | GND | BTN | 3V3 | GND | ST1 | STROMVY β | DT/B | ST2 | CLK/A | LDON | ENC | LED | + | - | SEN- | SEN+ | GND | BTN | LO2 | LSUP | LO1 | LSUP | NTC | 3.3V | LSUP | LCOM